# Altium schematic sheet USB.SchDoc
size A4; SheetNumber: 2; SheetTotal: 2
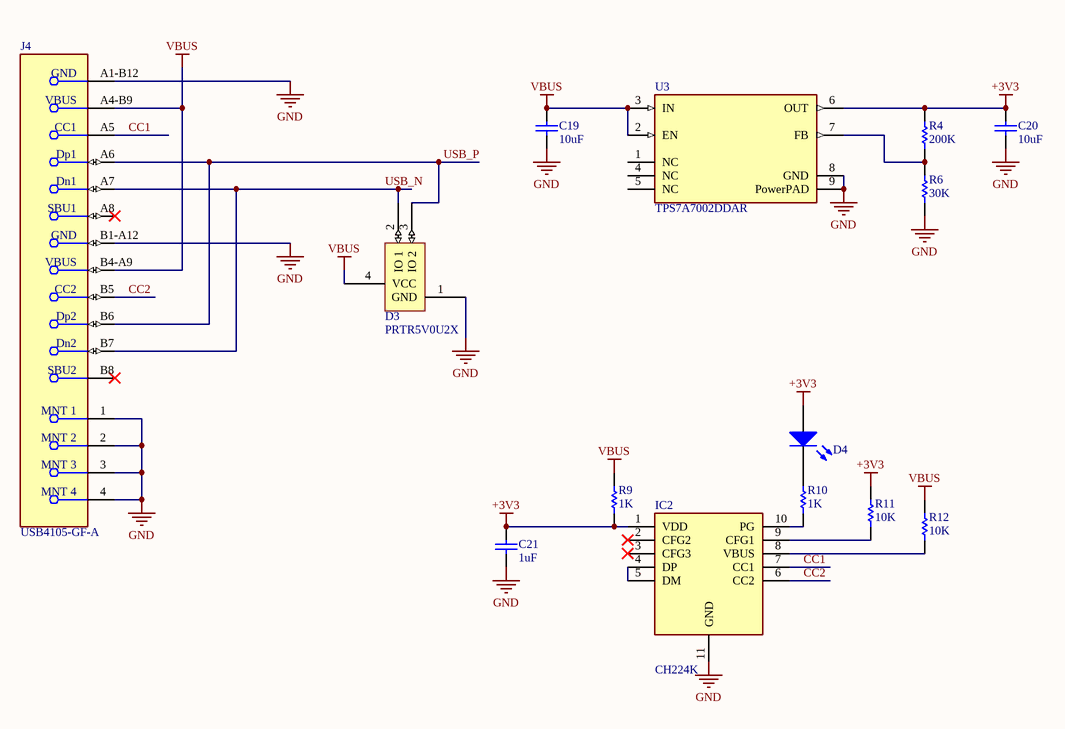
[diagram p0: USB.SchDoc]

## Parts
C19  10uF  [C603]
C20  10uF  [C603]
C21  1uF  [C603]
D3  PRTR5V0U2X  [SOT-143B]
D4  LED  [led-0603]  (value not drawn)
IC2  CH224K  [SOP100P600X180-11N]
J4  USB4105-GF-A  [FP-USB4105-GF-A-MFG]
R4  200K  [R0603]
R6  30K  [R0603]
R9  1K  [R0603]
R10  1K  [R0603]
R11  10K  [R0603]
R12  10K  [R0603]
U3  TPS7A7002DDAR  [FP-DDA0008E-IPC_A]

## Nets
+3V3: C20.2 C21.2 D4.1(A) IC2.1(VDD) R4.2 R9.1 R11.2 U3.6(OUT)
GND: C19.1 C20.1 C21.1 D3.1(GND) IC2.11(GND) J4.1(MNT_1) J4.2(MNT_2) J4.3(MNT_3) J4.4(MNT_4) J4.A1-B12(GND) J4.B1-A12(GND) R6.1 U3.8(GND) U3.9(PowerPAD)
VBUS: C19.2 D3.4(VCC) J4.A4-B9(VBUS) J4.B4-A9(VBUS) R9.2 R12.2 U3.2(EN) U3.3(IN)
CC1: IC2.7(CC1) J4.A5(CC1)
CC2: IC2.6(CC2) J4.B5(CC2)
USB_N: D3.2(IO_1) J4.A7(Dn1) J4.B7(Dn2)
USB_P: D3.3(IO_2) J4.A6(Dp1) J4.B6(Dp2)
NetD4_2: D4.2(K) R10.2
NetIC2_4: IC2.4(DP) IC2.5(DM)
NetIC2_8: IC2.8(VBUS) R12.1
NetIC2_9: IC2.9(CFG1) R11.1
NetIC2_10: IC2.10(PG) R10.1
NetR4_1: R4.1 R6.2 U3.7(FB)

Not connected (* = marked no-connect by the designer): IC2 2(CFG2)* 3(CFG3)*; J4 A8(SBU1)* B8(SBU2)*; U3 1(NC) 4(NC) 5(NC)

## Library data of the parts
C19-C21 = Cap: Capacitor; Designer: Parsa Malekpour
  C19 C20: Value: 10uF
  C21: Value: 1uF
D3 = PRTR5V0U2X: Ultra low capacitance double rail-to-rail ESD protection diode; reverse standoff voltage: 5.5V
IC2 = CH224K: Integrated Circuit; Manufacturer_Name: WCH; Datasheet Link: https://datasheet.lcsc.com/lcsc/2204251615_WCH-Jiangsu-Qin-Heng-CH224K_C970725.pdf; Height: 1.8mm; Manufacturer_Part_Number: CH224K
J4 = CMP-245163-000001-1: CONN RCPT USB2.0 TYPEC 5A; Manufacturer: GCT; Voltage Rating: 20V; Is Female: yes; Current Rating: 5/6.25/1.25/0.25A; Number Of Contacts: 16; Conn Orientation: Right Angle; Device Class L1: Connectors; Category: Conn; Lead Free: Yes; RoHS: TRUE; Temperature Range High: +85°C; Digikey Description: CONN RCPT USB2.0 TYPEC 5A; Device Class L3: unset; ComponentLink2Description: Datasheet; Manufacturer Part Number: USB4105-GF-A; Package: 0; Usb Standard: USB 2.0; Device Class L2: USB Connectors; Automotive: No; Temperature Range Low: -40°C; Height: 3.46mm; Temperature: -40°C to +85°C; Contact Material: Gold,Nickel; ComponentLink2URL: https://gct.co/files/drawings/usb4105.pdf; Octopart: https://octopart.com/usb4105-gf-a-gct-106627878
R4 R6 R9-R12 = Resistor: Designer: Parsa Malekpour
  R4: Value: 200K
  R6: Value: 30K
  R9 R10: Value: 1K
  R11 R12: Value: 10K
U3 = CMP-04917-000116-1: IC REG LIN POS ADJ 3A 8SO PWRPAD; Accuracy: 3%; Min Input Voltage: 1.425V; Dropout Voltage: 200mV; Max Input Voltage: 6.5V; Output Voltage: 5V; Min Current Limit: 3.36A; Number of Outputs: 1; Quiescent Current: 3mA; Polarity: Positive; Output Type: Adjustable; Min Operating Temperature: -40°C; Mount: Surface Mount; Package Quantity: 2500; Contact Plating: Gold; Max Output Current: 3A; Output Current: 3A; Number of Pins: 8; RoHS Compliant: Yes; Max Operating Temperature: 125°C; Lead Free: Lead Free; Packaging: Tape and Reel; Number of Regulators: 1